# EAGLE schematic DB18S20_Sensor (EAGLE 7.1.0)
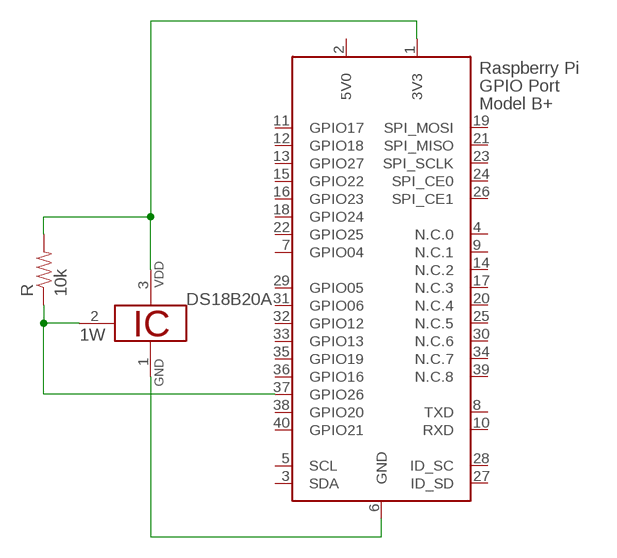
[diagram p0: schematic, sheet 1]

## Parts
DS18B20  DS18B20  [TO92-]
R  10k  RESISTOREZ  [AXIAL-0.3EZ]
X1  RASPI_BOARD_B+_E0  [RASPI_BOARD_B+_EDGES_0DRILL]

## Nets
N$1: DS18B20.1 X1.6(GND)
N$2: DS18B20.3 R.P$2 X1.1(3V3)
N$4: DS18B20.2 R.P$1 X1.37(GPIO26)
Unconnected: X1.3(SDA) X1.4(N.C.0) X1.5(SCL) X1.7(GPIO04) X1.8(TXD) X1.9(N.C.1) X1.10(RXD) X1.11(GPIO17) X1.12(GPIO18) X1.13(GPIO27) X1.14(N.C.2) X1.15(GPIO22) X1.16(GPIO23) X1.17(N.C.3) X1.18(GPIO24) X1.19(SPI_MOSI) X1.20(N.C.4) X1.21(SPI_MISO) X1.22(GPIO25) X1.23(SPI_SCLK) X1.24(SPI_CE0) X1.25(N.C.5) X1.26(SPI_CE1) X1.27(ID_SD) X1.28(ID_SC) X1.29(GPIO05) X1.30(N.C.6) X1.31(GPIO06) X1.32(GPIO12) X1.33(GPIO13) X1.34(N.C.7) X1.35(GPIO19) X1.36(GPIO16) X1.38(GPIO20) X1.39(N.C.8) X1.40(GPIO21)

## Power pins joined to a net without a drawn wire
5V0: X1.2(5V0)

## Library data of the parts
DS18B20 = ds18b20:DS18B20: Programmable Resolution Digital Thermometer This chip provides a onewire thermosensor with approx. 0.5°C accuracy. A programmable over/undertemperure alarm is available. The precision can be set from 9..12 bits. Notes: Vdd must be applied for accurate measurements at low temperatures, as the parasite power circuit otherwise heats the sensor. If parasite power is used, Vdd has to be connected to GND. The DS1822 is a low-cost thermometer chip, the DS18S20 is similar to the DS18B20, but with 9 Bit precision only. Author: Jan Kandziora <jjj@gmx.de>
R = SparkFun-Resistors:RESISTOR: Resistor Basic schematic elements and footprints for 0603, 1206, and PTH resistors.
X1 = raspberrypi_bastelstube_v13:RASPI_BOARD_B+: Raspberry Pi GPIO connector with markings for the outer dimensions of the Raspberry Pi board model B+ with different sets of drill holes or mounting pads